# EasyEDA Pro project 电路原理图和PCB图.eprj

# Schematic Schematic2_1
Board Name: Board2_1; Create Date: 2024-09-04; Page Name: P1_1; Project Name: 电路原理图和PCB图; Schematic Name: Schematic2_1; Update Date: 2026-04-20; Company: 23光信1; Reviewed: 何晓燊; Version: V114.514
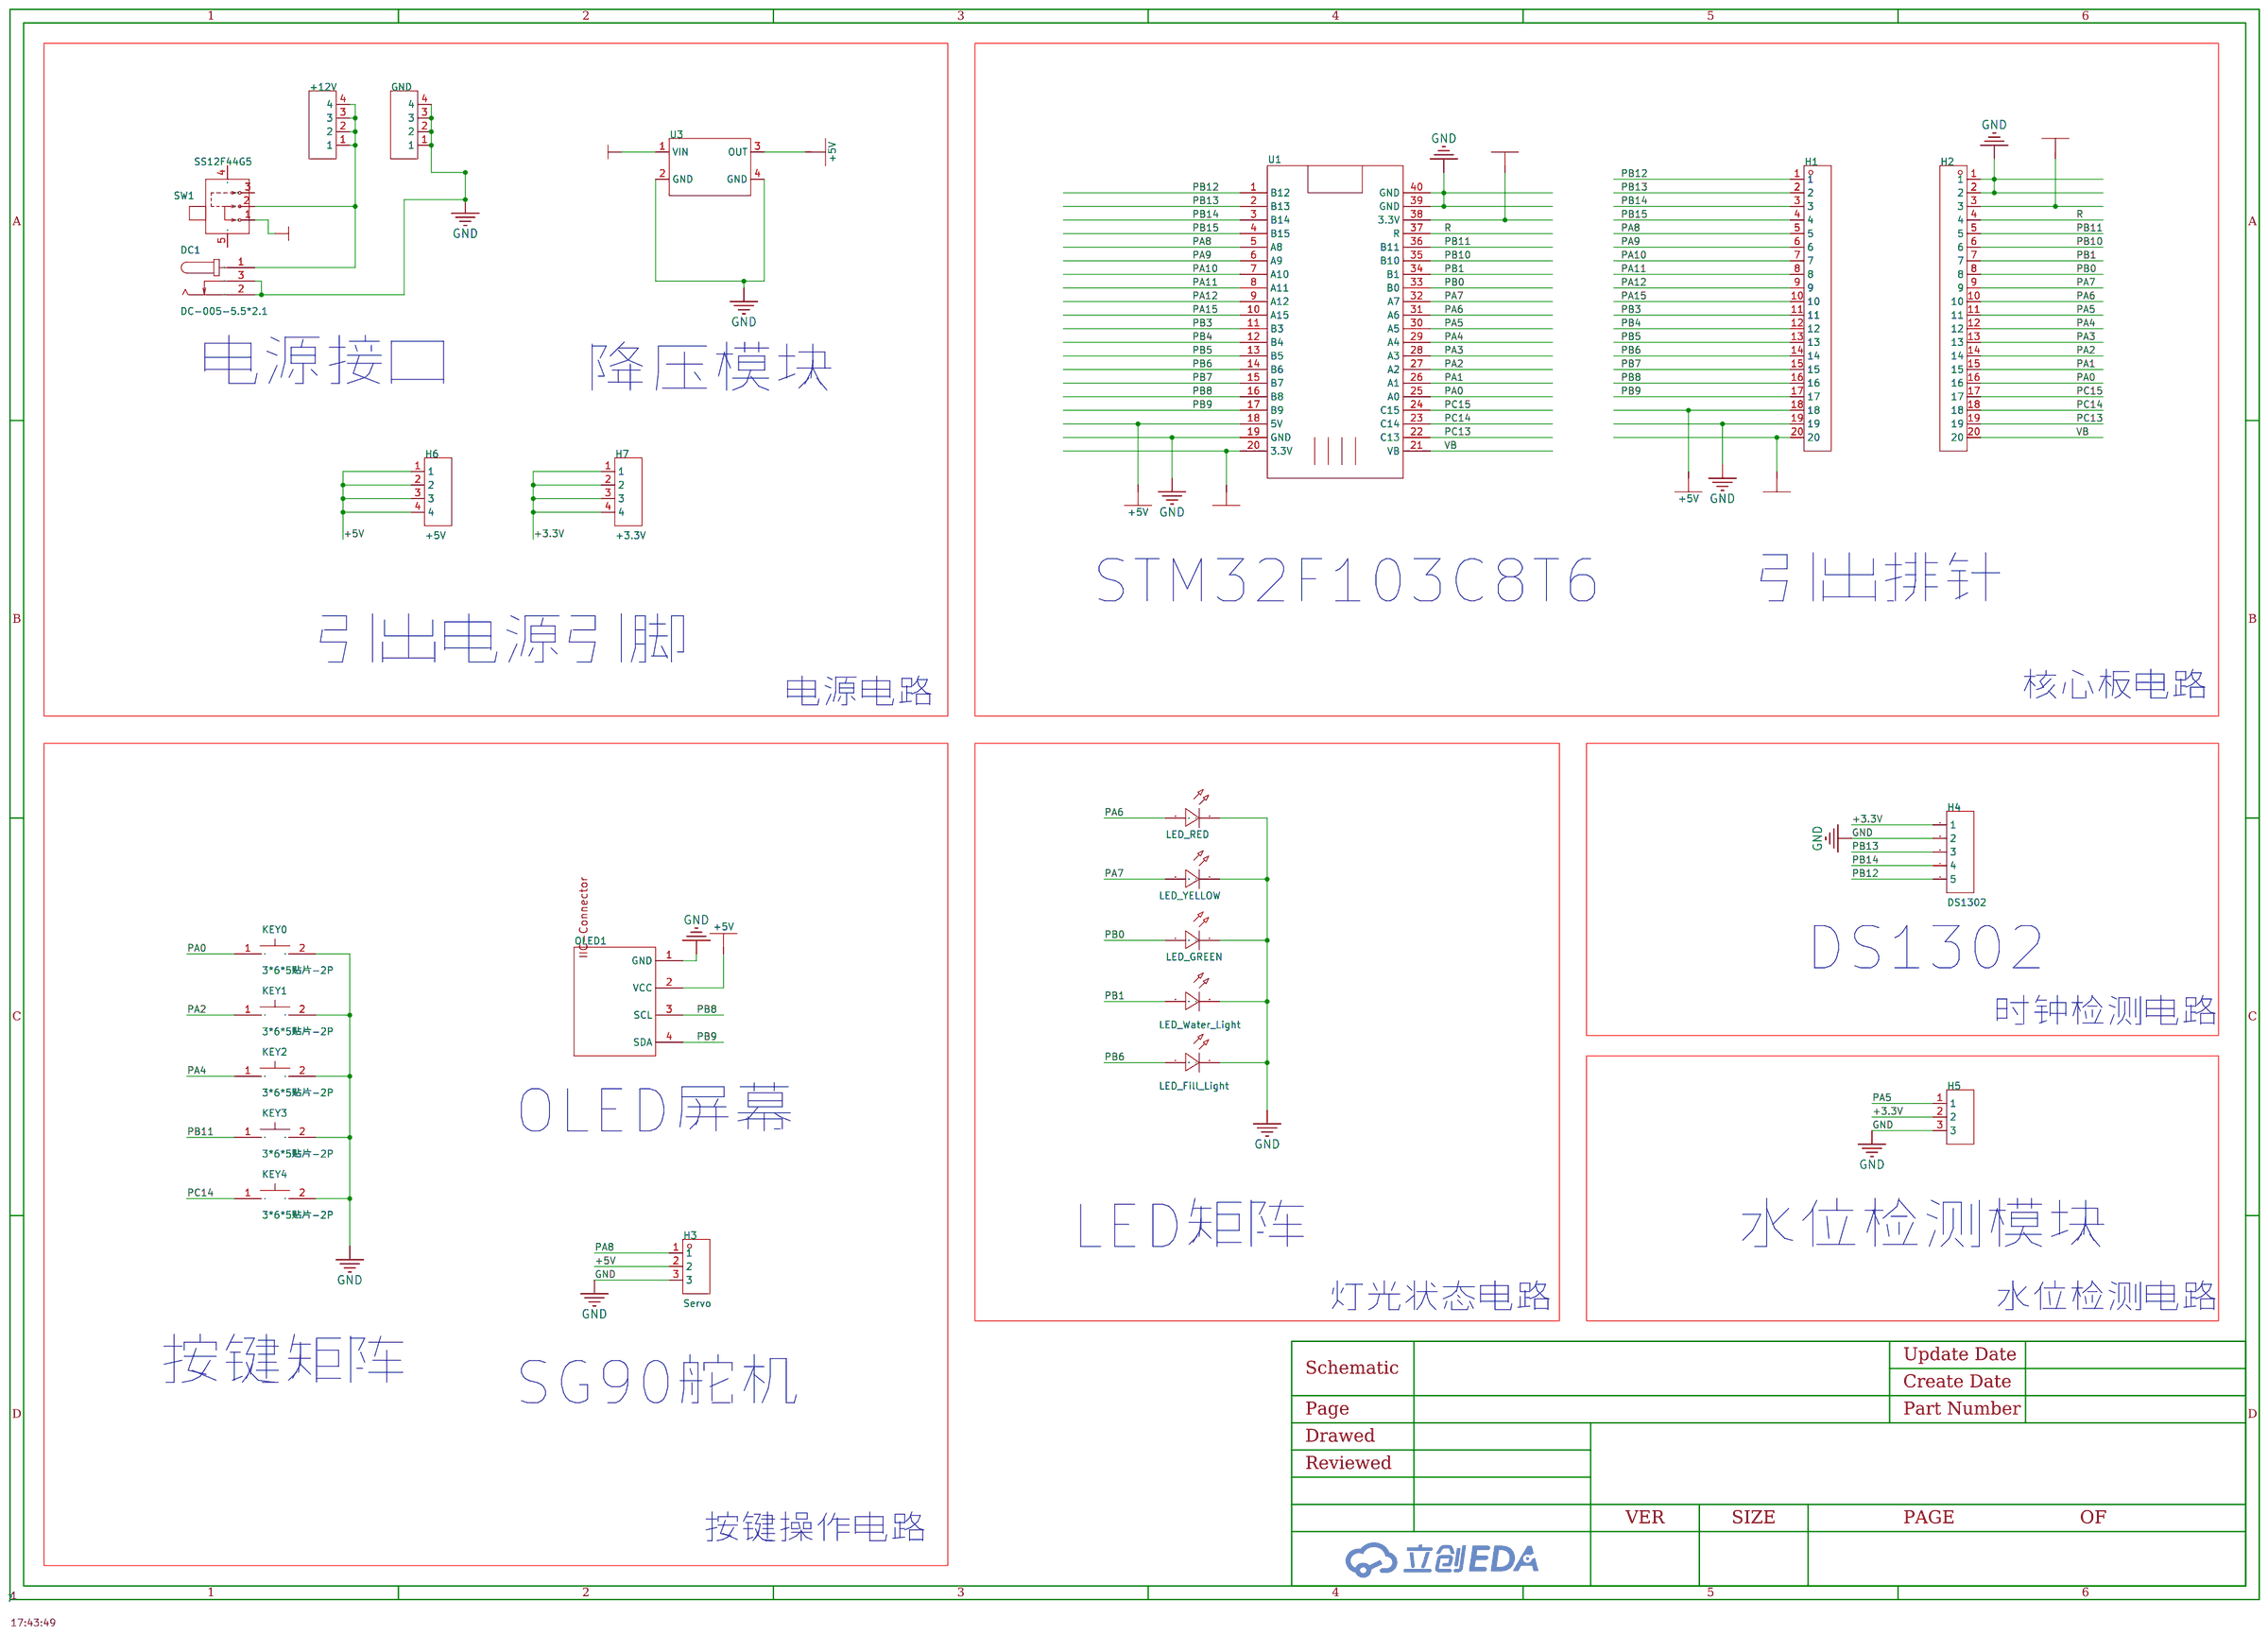
[diagram p0: schematic sheet]

## Parts
+12V  -  [HDR-TH_4P-P2.54-V-M]
DC1  DC-005-5.5*2.1  [DC-IN-TH_DC-005-2]
GND  -  [HDR-TH_4P-P2.54-V-M]
H1  -  [HDR-TH_20P-P2.54-V-M-1]
H2  -  [HDR-TH_20P-P2.54-V-M-1]
H3  Servo  [HDR-TH_3P-P2.54-V-M]
H4  DS1302  [HDR-TH_5P-P2.54-V-F]
H5  -  [HDR-TH_3P-P2.54-V-F]
H6  +5V  [HDR-TH_4P-P2.54-V-M]
H7  +3.3V  [HDR-TH_4P-P2.54-V-M]
KEY0  3*6*5贴片-2P  [SW-SMD_L6.0-W3.5-LS8.0]
KEY1  3*6*5贴片-2P  [SW-SMD_L6.0-W3.5-LS8.0]
KEY2  3*6*5贴片-2P  [SW-SMD_L6.0-W3.5-LS8.0]
KEY3  3*6*5贴片-2P  [SW-SMD_L6.0-W3.5-LS8.0]
KEY4  3*6*5贴片-2P  [SW-SMD_L6.0-W3.5-LS8.0]
LED_Fill_Light  -  [LED_TH-_5mm]
LED_GREEN  -  [LED_TH-_5mm]
LED_RED  -  [LED_TH-_5mm]
LED_Water_Light  -  [LED_TH-_5mm]
LED_YELLOW  -  [LED_TH-_5mm]
OLED1  -  [0.96OLED_4P]
SW1  SS12F44G5  [SW-TH_SHOU-HAN_SS12F44G4]
U1  -  [STM32F103C8T6核心板]
U3  -  [MP1584模块]

## Library data of the parts
+12V GND H6 H7 = HDR-M_2.54_1x4P: Supplier Part: C492403; Supplier Footprint: 插件
DC1 = DC-005-5.5*2.1: Supplier Part: C9900017044; Supplier Footprint: DC-005; JLCPCB Part Class: 扩展库; Supplier: LCSC
H1 H2 = HDR-M_2.54_1x20P: Supplier Part: C50981; Supplier Footprint: 插件
H3 = HDR-M_2.54_1x3P: Supplier Part: C2937625; Supplier Footprint: 插件
H4 = HDR-F_2.54_1x5P: Supplier Part: C50950; Supplier Footprint: 插件
H5 = HDR-F_2.54_1x3P: Supplier Part: C541850; Supplier Footprint: 插件
KEY0-KEY4 = 3*6*5贴片-2P: Supplier Part: C9900011307; Supplier Footprint: SW-SMD; JLCPCB Part Class: 扩展库; Supplier: LCSC
LED_Fill_Light LED_Water_Light LED_YELLOW = LED_TH-B_5mm: Supplier Footprint: 插件
LED_GREEN = LED_TH-G_5mm: Supplier Footprint: 插件
LED_RED = LED_TH-R_5mm: Supplier Footprint: 插件
OLED1 = 0.96OLED_4P: LCSC Part Name: 0.96OLED_4P_MODULE_JX; Supplier Part: C9900004566; Manufacturer Part: 0.96OLED_4P_MODULE_JX; Supplier Footprint: THrough hole; JLCPCB Part Class: Extended Part; Supplier: LCSC
SW1 = SS12F44G5: Supplier Part: C22435641; Manufacturer: HanElectricity(瀚源); Supplier Footprint: 插件-5P,12.2x5.5mm; JLCPCB Part Class: 扩展库; Datasheet: https://atta.szlcsc.com/upload/public/pdf/source/20240521/251CCE5309E68669C05257185F219EB8.pdf; Supplier: LCSC
U1 = stm32f103c8t6最小系统板
U3 = MP1584模块: Pin Type: IN

## Nets
+3.3V: H1.20 H2.3 H4.1 H5.2 H7.1 H7.2 H7.3 H7.4 U1.20(3.3V) U1.38(3.3V)
+5V: H1.18 H3.2 H6.1 H6.2 H6.3 H6.4 OLED1.2(VCC) U1.18(5V) U3.3(OUT)
+12V: SW1.1 U3.1(VIN)
GND: DC1.2 DC1.3 GND.1 GND.2 GND.3 GND.4 H1.19 H2.1 H2.2 H3.3 H4.2 H5.3 KEY0.2 KEY1.2 KEY2.2 KEY3.2 KEY4.2 LED_Fill_Light.2(A) LED_GREEN.2(A) LED_RED.2(A) LED_Water_Light.2(A) LED_YELLOW.2(A) OLED1.1(GND) U1.19(GND) U1.39(GND) U1.40(GND) U3.2(GND) U3.4(GND)
PA0: H2.16 KEY0.1 U1.25(A0)
PA1: H2.15 U1.26(A1)
PA2: H2.14 KEY1.1 U1.27(A2)
PA3: H2.13 U1.28(A3)
PA4: H2.12 KEY2.1 U1.29(A4)
PA5: H2.11 H5.1 U1.30(A5)
PA6: H2.10 LED_RED.1(C) U1.31(A6)
PA7: H2.9 LED_YELLOW.1(C) U1.32(A7)
PA8: H1.5 H3.1 U1.5(A8)
PA9: H1.6 U1.6(A9)
PA10: H1.7 U1.7(A10)
PA11: H1.8 U1.8(A11)
PA12: H1.9 U1.9(A12)
PA15: H1.10 U1.10(A15)
PB0: H2.8 LED_GREEN.1(C) U1.33(B0)
PB1: H2.7 LED_Water_Light.1(C) U1.34(B1)
PB3: H1.11 U1.11(B3)
PB4: H1.12 U1.12(B4)
PB5: H1.13 U1.13(B5)
PB6: H1.14 LED_Fill_Light.1(C) U1.14(B6)
PB7: H1.15 U1.15(B7)
PB8: H1.16 OLED1.3(SCL) U1.16(B8)
PB9: H1.17 OLED1.4(SDA) U1.17(B9)
PB10: H2.6 U1.35(B10)
PB11: H2.5 KEY3.1 U1.36(B11)
PB12: H1.1 H4.5 U1.1(B12)
PB13: H1.2 H4.3 U1.2(B13)
PB14: H1.3 H4.4 U1.3(B14)
PB15: H1.4 U1.4(B15)
PC13: H2.19 U1.22(C13)
PC14: H2.18 KEY4.1 U1.23(C14)
PC15: H2.17 U1.24(C15)
R: H2.4 U1.37(R)
VB: H2.20 U1.21(VB)
Net-(+12V-1): +12V.1 +12V.2 +12V.3 +12V.4 DC1.1 SW1.2

Not connected (* = marked no-connect by the designer): SW1 3 4 5

## Notes on the sheet
- 电源接口
- 降压模块
- STM32F103C8T6
- 引出排针
- 引出电源引脚
- 核心板电路
- 电源电路
- DS1302
- 时钟检测电路
- OLED屏幕
- LED矩阵
- 水位检测模块
- 灯光状态电路
- 水位检测电路
- 按键矩阵
- SG90舵机
- 按键操作电路

# Board 标准版
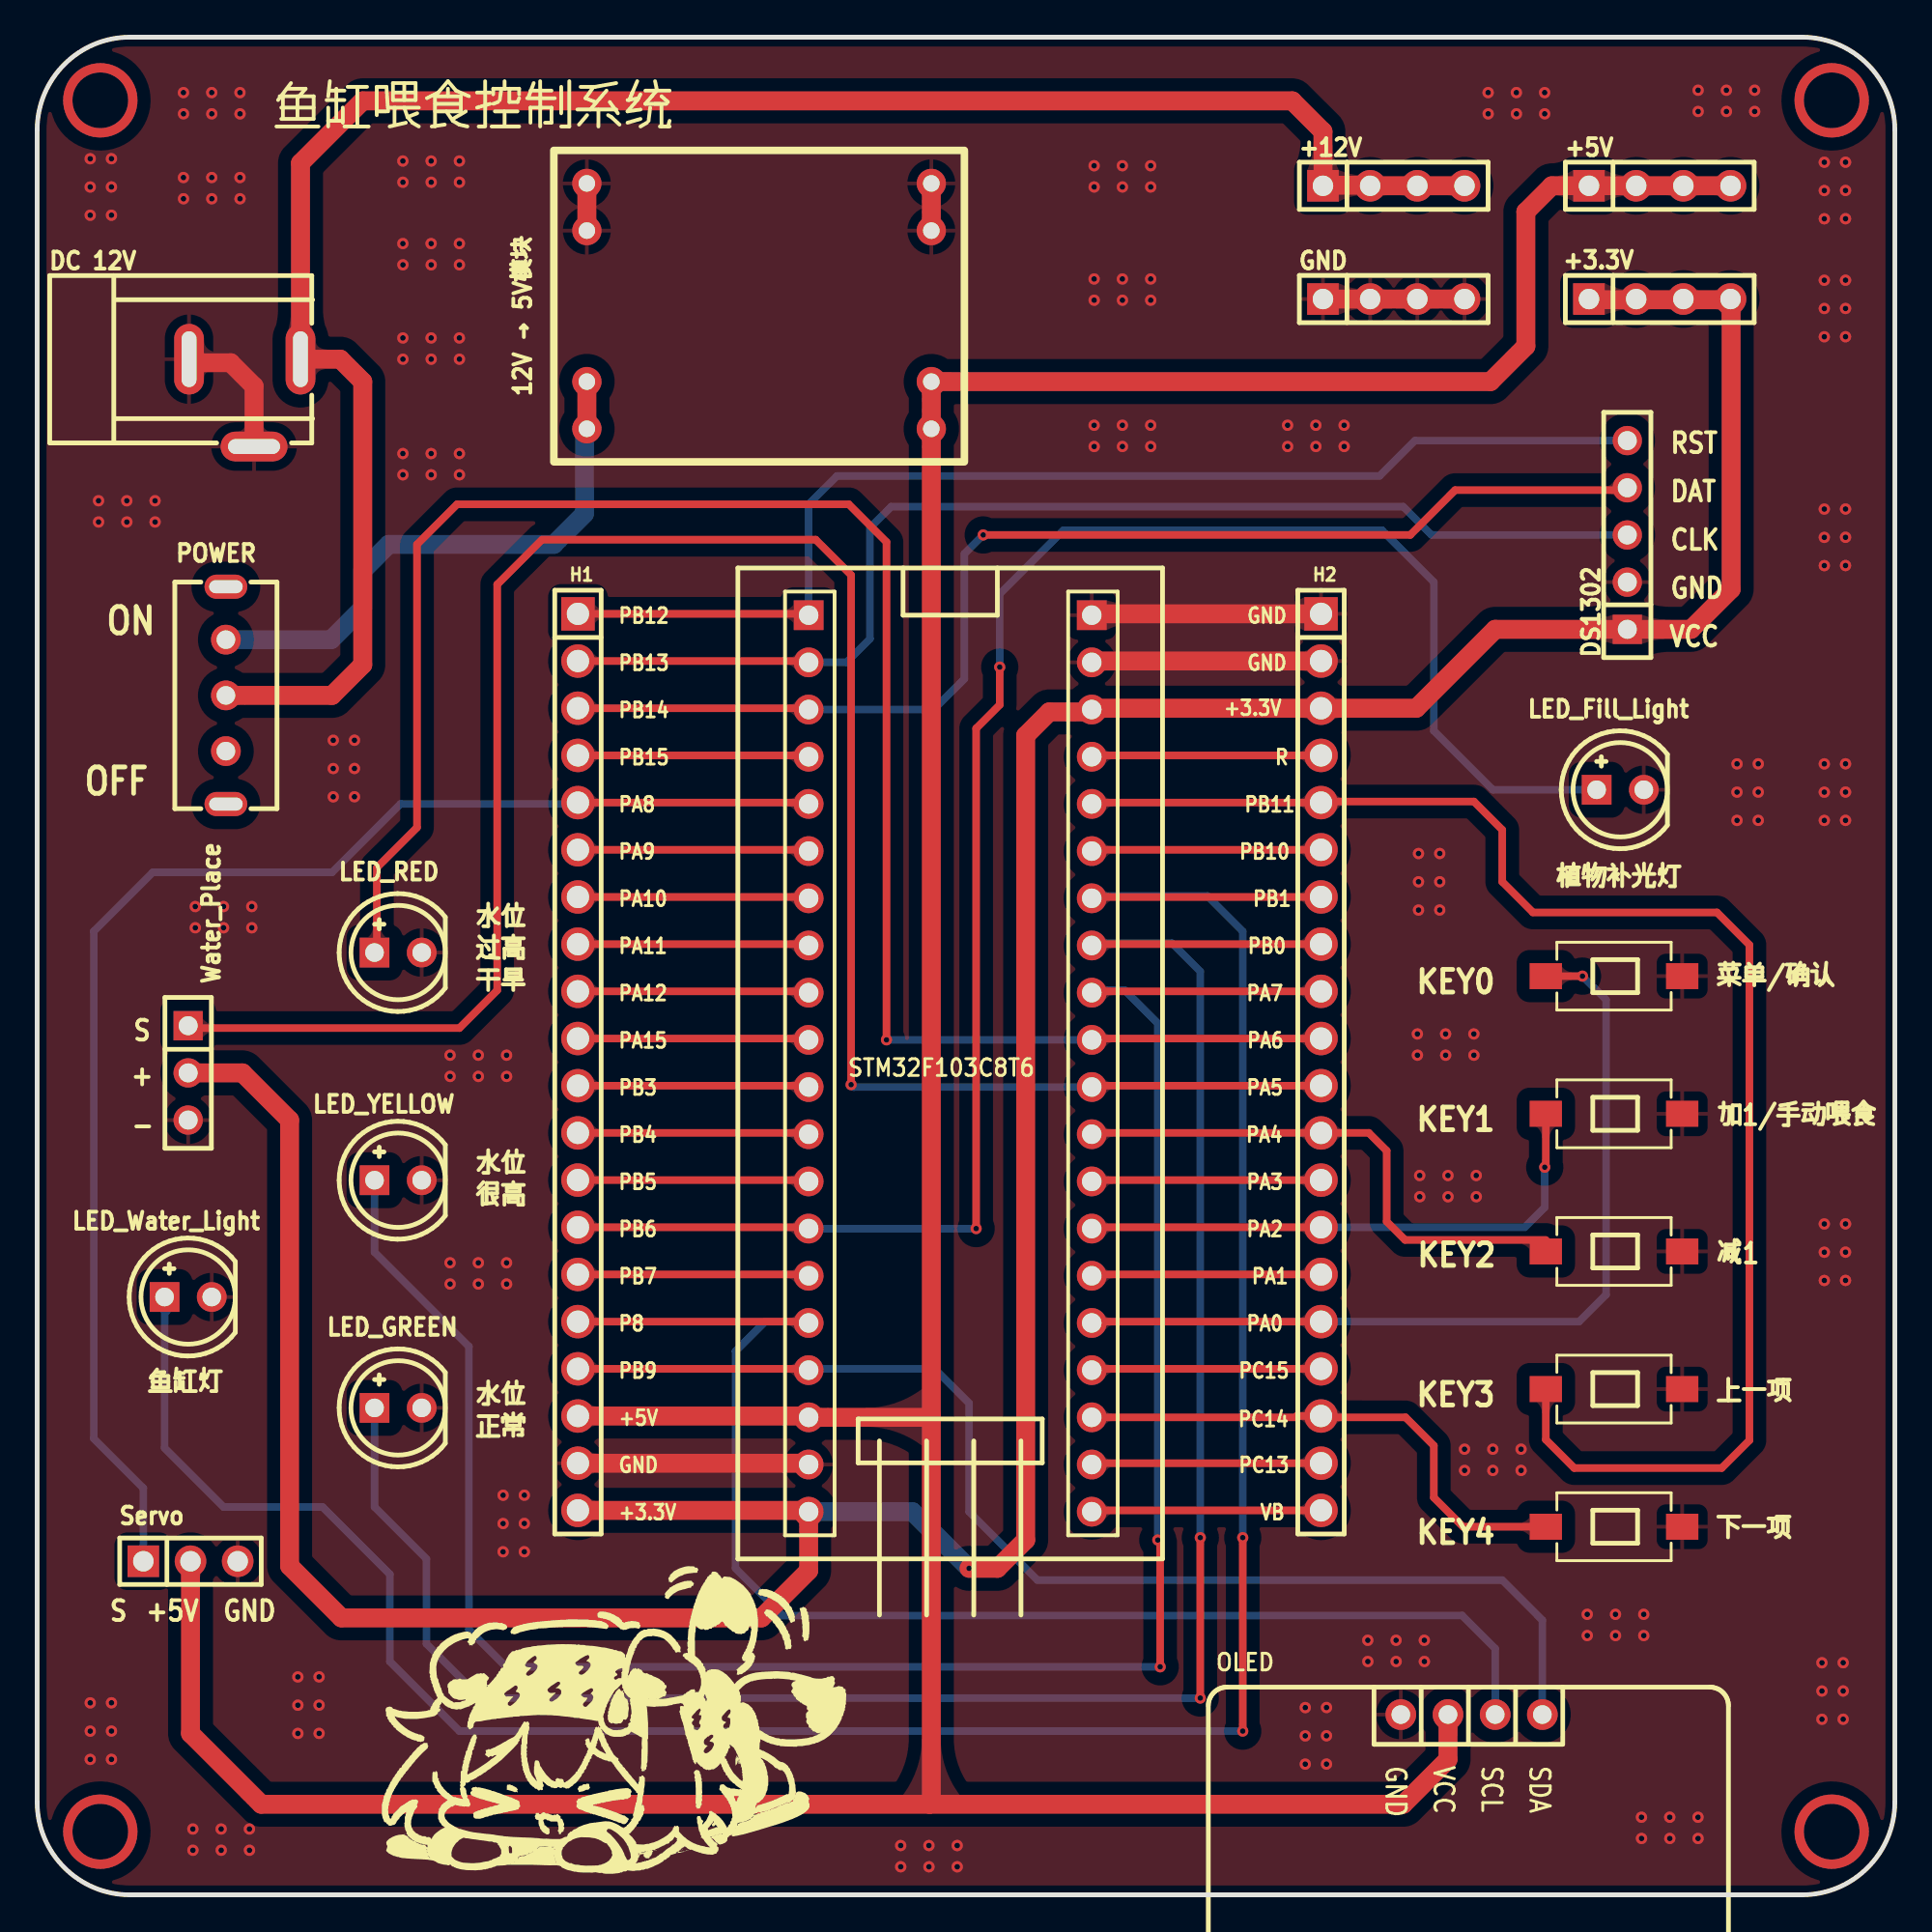
[diagram p1: board, top side]
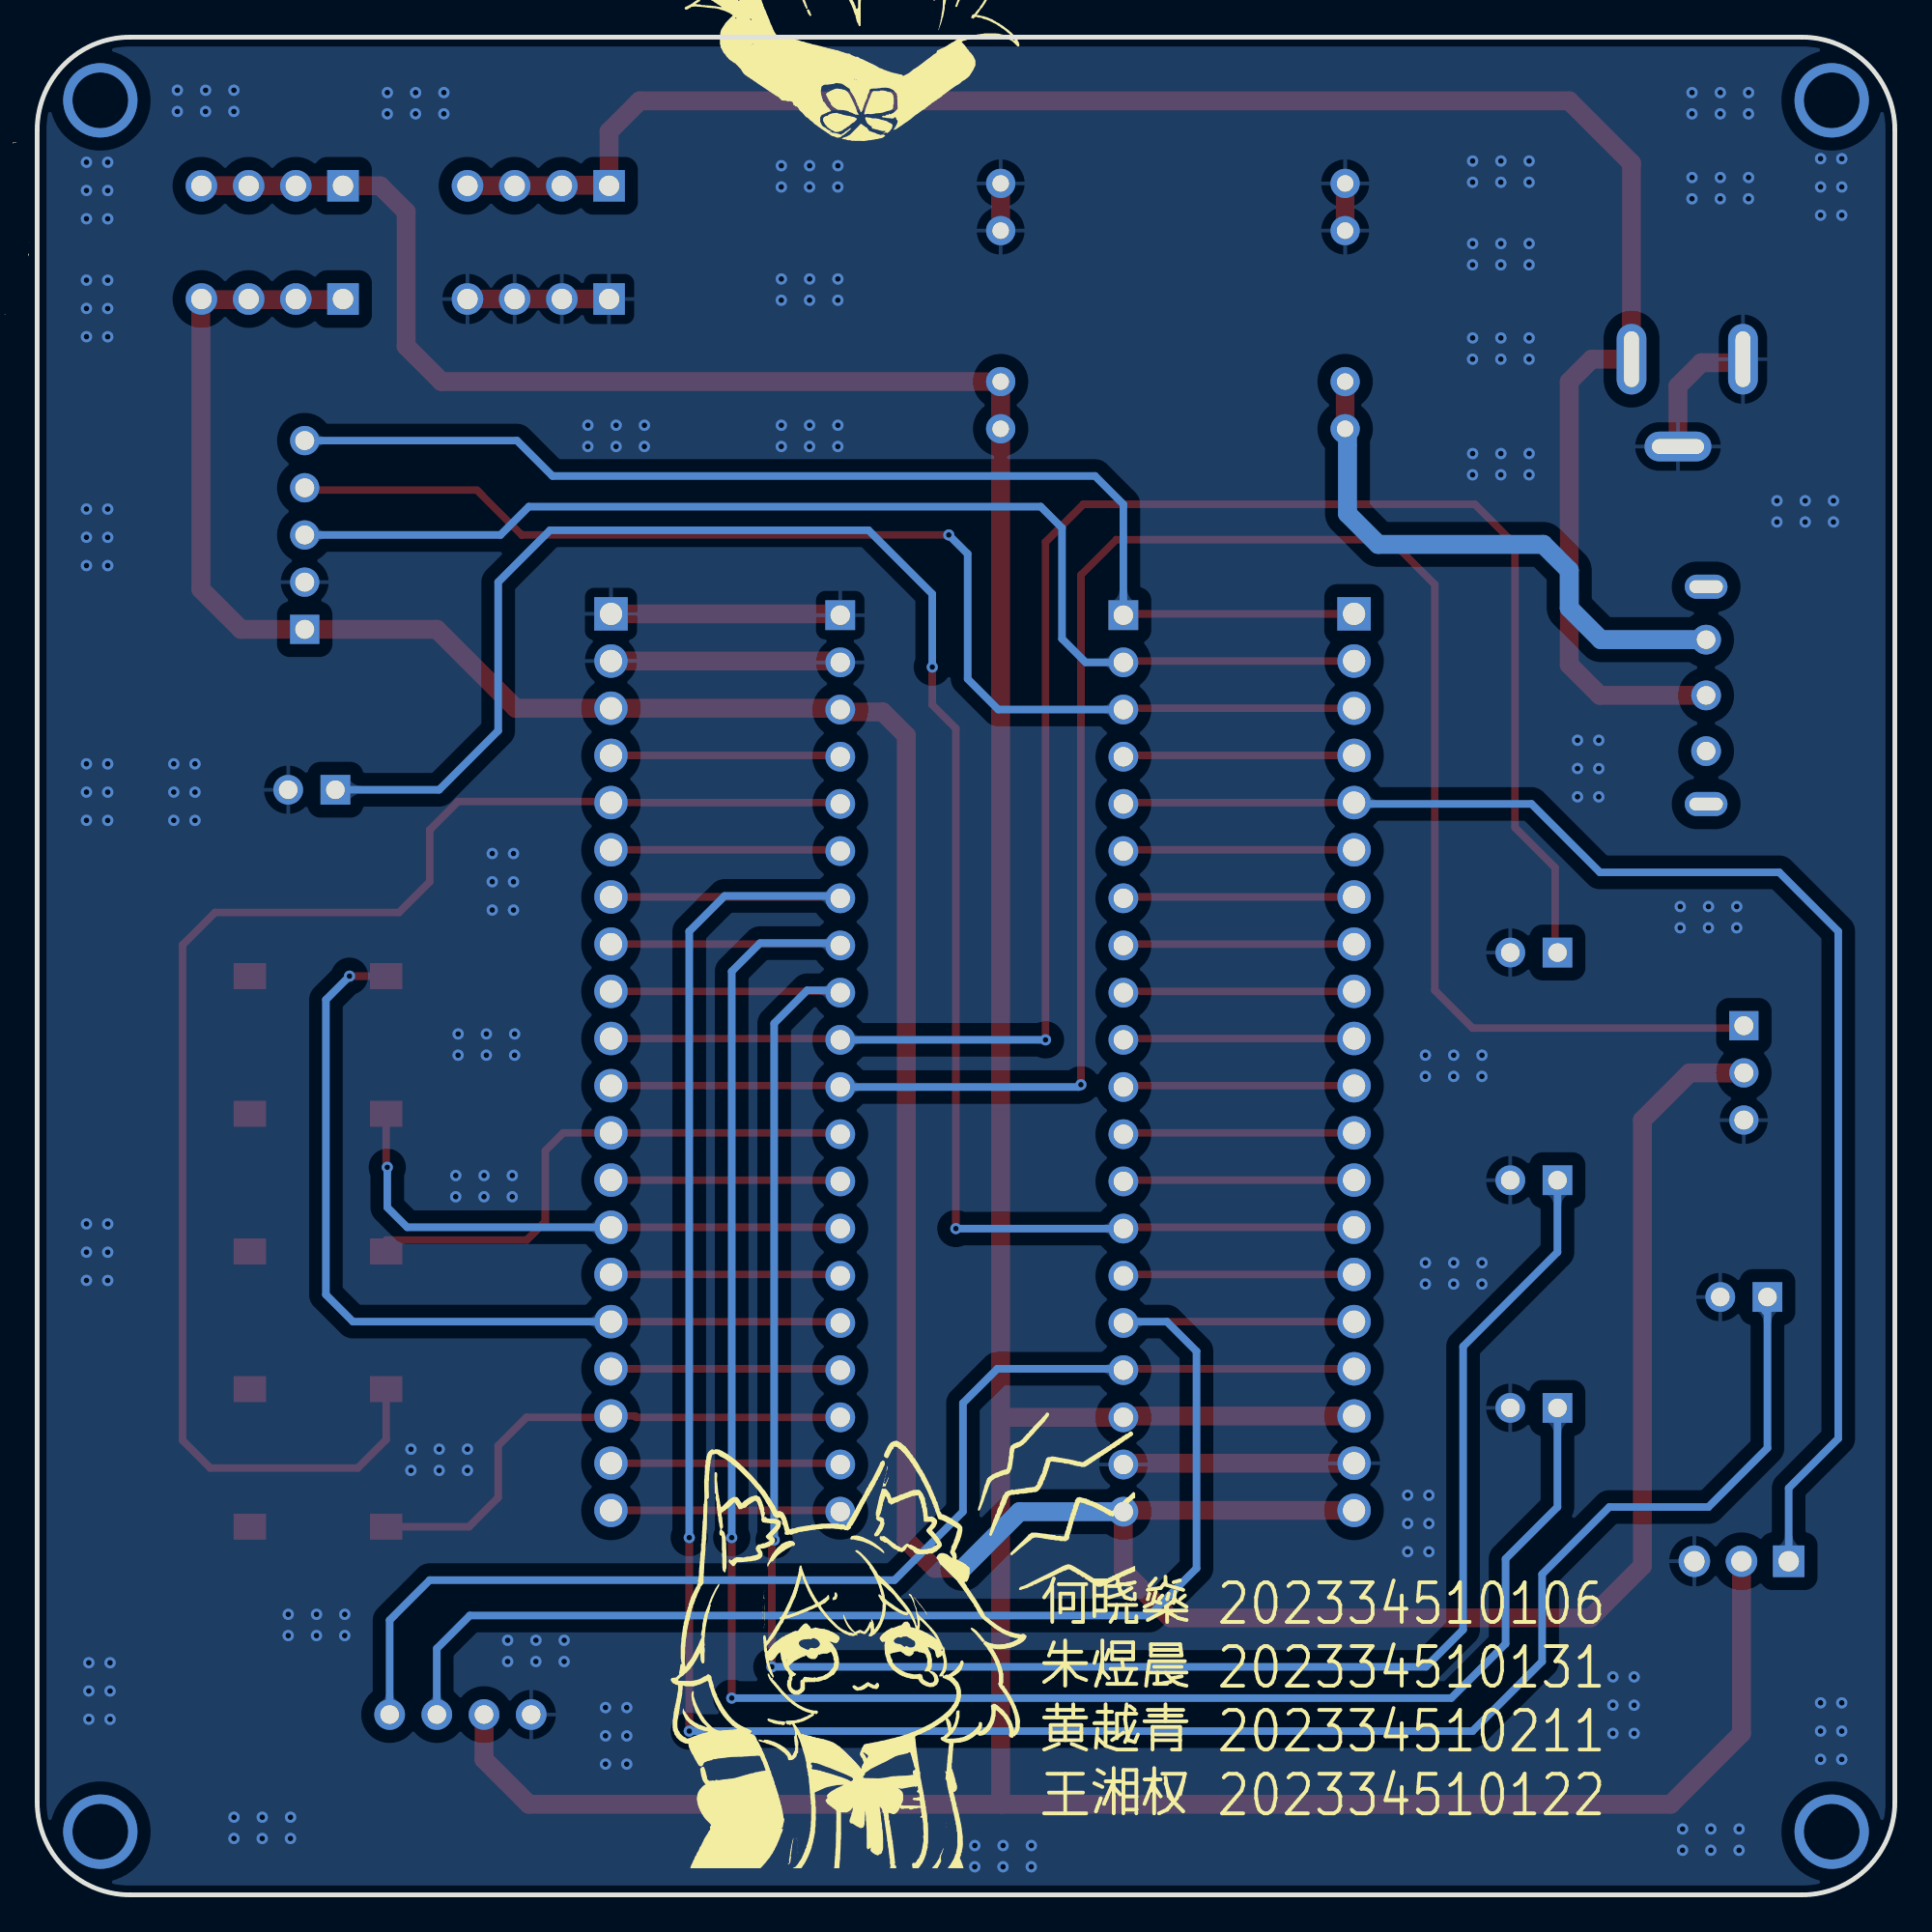
[diagram p2: board, bottom side, seen from below]

Outline 100 x 100 mm; copper layers: Top Layer, Bottom Layer. Coordinates in mm from the lower left corner of the outline.
Outline path: 0,95 0,5 arc(1.46,1.46) 5,0 95,0 arc(98.54,1.46) 100,5 100,95 arc(98.54,98.54) 95,100 5,100 arc(1.46,98.54) 0,95
Stack: Top Layer 0.035mm / Dielectric1 1.51mm FR4 er 4.5 / Bottom Layer 0.035mm

## Design rules (mm)
template: 用户自定义配置
spacing safeClearance (default): track to track 0.5, other pairs 0.5 to 0.5
track width trackWidth (default): min 0.127, default 0.254, max 2.54
differential pair differentialPair (default): width min 0.127, default 0.254, max 2.54; gap min 0.152, default 0.152
via viaSize (default): diameter min 0.5, default 0.61, max 10; hole min 0.3, default 0.305, max 6

## Placement (name value [footprint] x y rotation side)
12V → 5V模块  -  [MP1584模块]  38.86 85.52 0 top
+3.3V  +3.3V  [HDR-TH_4P-P2.54-V-M]  87.35 85.9 0 top
+5V  +5V  [HDR-TH_4P-P2.54-V-M]  87.35 92 0 top
+12V  -  [HDR-TH_4P-P2.54-V-M]  73.03 92 0 top
DC 12V  DC-005-5.5*2.1  [DC-IN-TH_DC-005-2]  11.18 80.31 0 top
DS1302  DS1302  [HDR-TH_5P-P2.54-V-F]  85.6 73.2 90 top
GND  -  [HDR-TH_4P-P2.54-V-M]  73.03 85.9 0 top
H1  -  [HDR-TH_20P-P2.54-V-M-1]  29.11 44.83 270 top
H2  -  [HDR-TH_20P-P2.54-V-M-1]  69.11 44.83 270 top
KEY0  3*6*5贴片-2P  [SW-SMD_L6.0-W3.5-LS8.0]  84.88 49.45 0 top
KEY1  3*6*5贴片-2P  [SW-SMD_L6.0-W3.5-LS8.0]  84.88 42.04 0 top
KEY2  3*6*5贴片-2P  [SW-SMD_L6.0-W3.5-LS8.0]  84.88 34.63 0 top
KEY3  3*6*5贴片-2P  [SW-SMD_L6.0-W3.5-LS8.0]  84.88 27.22 0 top
KEY4  3*6*5贴片-2P  [SW-SMD_L6.0-W3.5-LS8.0]  84.88 19.82 0 top
LED_Fill_Light  -  [LED_TH-_5mm]  85.22 59.49 0 top
LED_GREEN  -  [LED_TH-_5mm]  19.43 26.21 0 top
LED_RED  -  [LED_TH-_5mm]  19.43 50.72 0 top
LED_Water_Light  -  [LED_TH-_5mm]  8.13 32.18 0 top
LED_YELLOW  -  [LED_TH-_5mm]  19.43 38.47 0 top
OLED  -  [0.96OLED_4P]  77.22 9.7 0 top
POWER  SS12F44G5  [SW-TH_SHOU-HAN_SS12F44G4]  10.16 64.57 270 top
Servo  Servo  [HDR-TH_3P-P2.54-V-M]  8.25 17.96 0 top
STM32F103C8T6  -  [STM32F103C8T6核心板]  49.15 44.75 0 top
Water_Place  -  [HDR-TH_3P-P2.54-V-F]  8.13 44.25 270 top

## Footprints (pads in the part's own frame, mm; a bottom-side part is the same pattern mirrored in y, then rotated)
0.96OLED_4P
  round 1.651 hole 1.001: 1(-3.81,0) 2(-1.27,0.003) 3(1.27,0.003) 4(3.81,0.003)
DC-IN-TH_DC-005-2
  oval 1.6x3.8 hole 0.8x3: 1(2.999,2.35) 2(-3,2.35)
  oval 3.6x1.6 hole 2.8x0.8: 3(0.5,-2.35)
HDR-TH_3P-P2.54-V-F
  rect 1.575x1.575 hole 1.02: 1(-2.54,0)
  round 1.575 hole 1.02: 2(0,0) 3(2.54,0)
HDR-TH_3P-P2.54-V-M
  rect 1.7x1.7 hole 1.1: 1(-2.54,0)
  round 1.7 hole 1.1: 2(0,0) 3(2.54,0)
HDR-TH_4P-P2.54-V-M
  rect 1.7x1.7 hole 1.1: 1(-3.81,0)
  round 1.7 hole 1.1: 2(-1.27,0) 3(1.27,0) 4(3.81,0)
HDR-TH_5P-P2.54-V-F
  rect 1.575x1.575 hole 1.02: 1(-5.08,0)
  round 1.575 hole 1.02: 2(-2.54,0) 3(0,0) 4(2.54,0) 5(5.08,0)
HDR-TH_20P-P2.54-V-M-1
  rect 1.8x1.8 hole 1.2: 1(-24.13,0)
  round 1.8 hole 1.2: 2(-21.59,0) 3(-19.05,0) 4(-16.51,0) 5(-13.97,0) 6(-11.43,0) 7(-8.89,0) 8(-6.35,0) 9(-3.81,0) 10(-1.27,0) 11(1.27,0) 12(3.81,0) 13(6.35,0) 14(8.89,0) 15(11.43,0) 16(13.97,0) 17(16.51,0) 18(19.05,0) 19(21.59,0) 20(24.13,0)
LED_TH-_5mm
  rect 1.6x1.6 hole 1: 1(-1.27,0)
  round 1.6 hole 1: 2(1.27,0)
MP1584模块
  round 1.575 hole 0.889: 1(-9.271,-4.064) 1(-9.271,-6.604) 2(-9.271,6.604) 2(-9.271,4.064) 3(9.271,-4.064) 3(9.271,-6.604) 4(9.271,6.604) 4(9.271,4.064)
STM32F103C8T6核心板
  rect 1.6x1.6 hole 1.049: 1(-7.62,24.13) 40(7.62,24.13)
  round 1.6 hole 1.049: 2(-7.62,21.59) 3(-7.62,19.05) 4(-7.62,16.51) 5(-7.62,13.97) 6(-7.62,11.43) 7(-7.62,8.89) 8(-7.62,6.35) 9(-7.62,3.81) 10(-7.62,1.27) 11(-7.62,-1.27) 12(-7.62,-3.81) 13(-7.62,-6.35) 14(-7.62,-8.89) 15(-7.62,-11.43) 16(-7.62,-13.97) 17(-7.62,-16.51) 18(-7.62,-19.05) 19(-7.62,-21.59) 20(-7.62,-24.13) 21(7.62,-24.13) 22(7.62,-21.59) 23(7.62,-19.05) 24(7.62,-16.51) 25(7.62,-13.97) 26(7.62,-11.43) 27(7.62,-8.89) 28(7.62,-6.35) 29(7.62,-3.81) 30(7.62,-1.27) 31(7.62,1.27) 32(7.62,3.81) 33(7.62,6.35) 34(7.62,8.89) 35(7.62,11.43) 36(7.62,13.97) 37(7.62,16.51) 38(7.62,19.05) 39(7.62,21.59)
SW-SMD_L6.0-W3.5-LS8.0
  rect 1.74x1.4 smd: 1(-3.67,0) 2(3.67,0)
SW-TH_SHOU-HAN_SS12F44G4
  round 1.6 hole 1: 1(-3,0) 2(0,0) 3(3,0)
  oval 1.3x2.3 hole 0.7x1.8: 4(5.85,0) 5(-5.85,0)

## Nets
+3.3V: +3.3V.1 +3.3V.2 +3.3V.3 +3.3V.4 DS1302.1 H1.20 H2.3 STM32F103C8T6.20 STM32F103C8T6.38 Water_Place.2
+5V: 12V → 5V模块.3 +5V.1 +5V.2 +5V.3 +5V.4 H1.18 OLED.2 Servo.2 STM32F103C8T6.18
+12V: 12V → 5V模块.1 POWER.1
GND: 12V → 5V模块.2 12V → 5V模块.4 DC 12V.2 DC 12V.3 DS1302.2 GND.1 GND.2 GND.3 GND.4 H1.19 H2.1 H2.2 KEY0.2 KEY1.2 KEY2.2 KEY3.2 KEY4.2 LED_Fill_Light.2 LED_GREEN.2 LED_RED.2 LED_Water_Light.2 LED_YELLOW.2 OLED.1 Servo.3 STM32F103C8T6.19 STM32F103C8T6.39 STM32F103C8T6.40 Water_Place.3
PA0: H2.16 KEY0.1 STM32F103C8T6.25
PA1: H2.15 STM32F103C8T6.26
PA2: H2.14 KEY1.1 STM32F103C8T6.27
PA3: H2.13 STM32F103C8T6.28
PA4: H2.12 KEY2.1 STM32F103C8T6.29
PA5: H2.11 STM32F103C8T6.30 Water_Place.1
PA6: H2.10 LED_RED.1 STM32F103C8T6.31
PA7: H2.9 LED_YELLOW.1 STM32F103C8T6.32
PA8: H1.5 Servo.1 STM32F103C8T6.5
PA9: H1.6 STM32F103C8T6.6
PA10: H1.7 STM32F103C8T6.7
PA11: H1.8 STM32F103C8T6.8
PA12: H1.9 STM32F103C8T6.9
PA15: H1.10 STM32F103C8T6.10
PB0: H2.8 LED_GREEN.1 STM32F103C8T6.33
PB1: H2.7 LED_Water_Light.1 STM32F103C8T6.34
PB3: H1.11 STM32F103C8T6.11
PB4: H1.12 STM32F103C8T6.12
PB5: H1.13 STM32F103C8T6.13
PB6: H1.14 LED_Fill_Light.1 STM32F103C8T6.14
PB7: H1.15 STM32F103C8T6.15
PB8: H1.16 OLED.3 STM32F103C8T6.16
PB9: H1.17 OLED.4 STM32F103C8T6.17
PB10: H2.6 STM32F103C8T6.35
PB11: H2.5 KEY3.1 STM32F103C8T6.36
PB12: DS1302.5 H1.1 STM32F103C8T6.1
PB13: DS1302.3 H1.2 STM32F103C8T6.2
PB14: DS1302.4 H1.3 STM32F103C8T6.3
PB15: H1.4 STM32F103C8T6.4
PC13: H2.19 STM32F103C8T6.22
PC14: H2.18 KEY4.1 STM32F103C8T6.23
PC15: H2.17 STM32F103C8T6.24
R: H2.4 STM32F103C8T6.37
VB: H2.20 STM32F103C8T6.21
$3N3363: +12V.1 +12V.2 +12V.3 +12V.4 DC 12V.1 POWER.2

Pads without a net: POWER 3 4 5

## Via types
v1: diameter 4, hole 3, Top Layer to Bottom Layer, 4 vias
v2: diameter 0.61, hole 0.305, Top Layer to Bottom Layer, 228 vias
v3: diameter 0.6, hole 0.3, Top Layer to Bottom Layer, 14 vias

## Routing (per net, layer and track width the routed paths; a pad name or vN(x,y) marks a point on that pad's centre or on a via; arc(x,y) is an arc through that point)
+3.3V: length 197.1
  Top Layer w1.016: H1.20 41.49,20.7 41.53,20.66 41.53,17.45 38.99,14.91 16.38,14.91 13.59,17.7 13.59,41.71 11.05,44.25 Water_Place.2 ; 83.54,85.87 91.16,85.87 91.19,85.83 91.19,70.28 89.03,68.12 DS1302.1 78.49,68.12 74.24,63.88 H2.3 56.73,63.88 ; 56.26,63.68 54.48,63.68 53.21,62.41 53.21,19.1 51.69,17.58 v3(50.16,17.58)
  Bottom Layer w1.016: STM32F103C8T6.20 47.12,20.62 v3(50.16,17.58)
+5V: length 229.3
  Top Layer w1.016: 48.13,25.83 12V → 5V模块.3 12V → 5V模块.3 78.23,81.46 80.14,83.36 80.14,90.6 81.53,92 91.19,92 ; 48.13,25.83 48.01,25.71 41.56,25.71 41.49,25.78 H1.18 ; 48.13,25.83 48.13,4.96 48.05,4.88 ; 48.05,4.88 12.06,4.88 8.25,8.69 Servo.2 ; 48.05,4.88 73.53,4.88 75.95,7.29 OLED.2
+12V: length 30.5
  Top Layer w1.016: 12V → 5V模块.1 12V → 5V模块.1
  Bottom Layer w1.016: 12V → 5V模块.1 29.46,78.79 29.46,74.35 27.81,72.69 18.92,72.69 17.53,71.3 17.53,69.27 15.83,67.57 POWER.1
GND: length 57.2
  Top Layer w1.016: 12V → 5V模块.2 12V → 5V模块.2 ; GND.4 GND.3 GND.2 GND.1 ; DC 12V.3 11.68,81.21 10.41,82.47 8.37,82.47 DC 12V.2 ; 56.73,68.96 H2.1 ; H1.19 41.49,23.24 ; 56.73,66.42 H2.2 ; 12V → 5V模块.4 12V → 5V模块.4
  vias: v2(2.86,93.46) v2(2.86,91.93) v2(2.86,90.41) v2(2.86,10.33) v2(2.86,8.81) v2(2.86,7.29) v2(3.3,75.04) v2(3.31,73.9) v2(4,93.46) v2(4,91.94) v2(4,90.42) v2(4,10.34) v2(4,8.82) v2(4,7.29) v2(4.82,75.04) v2(4.83,73.9) v2(6.35,75.04) v2(6.35,73.9) v2(7.88,97.02) v2(7.88,95.87) v2(7.88,92.44) v2(7.88,91.3) v2(8.38,3.54) v2(8.39,2.4) v2(8.51,53.2) v2(8.51,52.06) v2(9.4,97.02) v2(9.4,95.87) v2(9.4,92.44) v2(9.4,91.3) v2(9.9,3.54) v2(9.91,2.4) v2(10.03,53.2) v2(10.03,52.06) v2(10.92,97.02) v2(10.92,95.87) v2(10.92,92.44) v2(10.92,91.3) v2(11.43,3.54) v2(11.43,2.4) v2(11.55,53.2) v2(11.56,52.06) v2(14.03,11.73) v2(14.03,10.21) v2(14.03,8.69) v2(15.18,11.73) v2(15.18,10.21) v2(15.18,8.69) v2(15.94,62.15) v2(15.94,60.63) v2(15.94,59.11) v2(17.08,62.15) v2(17.08,60.63) v2(17.08,59.11) v2(19.69,93.33) v2(19.69,92.19) v2(19.69,88.89) v2(19.69,87.74) v2(19.69,83.81) v2(19.69,82.66) v2(19.69,77.58) v2(19.69,76.44) v2(21.21,93.33) v2(21.21,92.19) v2(21.21,88.89) v2(21.21,87.74) v2(21.21,83.81) v2(21.21,82.66) v2(21.21,77.58) v2(21.21,76.44) v2(22.23,45.2) v2(22.23,44.06) v2(22.23,34.02) v2(22.23,32.88) v2(22.73,93.33) v2(22.73,92.19) v2(22.73,88.89) v2(22.73,87.74) v2(22.73,83.81) v2(22.73,82.66) v2(22.73,77.58) v2(22.73,76.44) v2(23.75,45.2) v2(23.75,34.02) v2(23.75,44.06) v2(23.75,32.88) v2(25.08,21.51) v2(25.08,19.99) v2(25.08,18.47) v2(25.27,45.2) v2(25.27,44.06) v2(25.27,34.02) v2(25.27,32.88) v2(26.23,21.51) v2(26.23,19.99) v2(26.23,18.47) v2(46.48,2.65) v2(46.49,1.51) v2(48,2.65) v2(48.01,1.51) v2(49.53,2.65) v2(49.53,1.51) v2(56.9,93.08) v2(56.9,91.94) v2(56.9,86.98) v2(56.9,85.84) v2(56.9,79.11) v2(56.9,77.97) v2(58.42,93.08) v2(58.42,91.94) v2(58.42,86.98) v2(58.42,85.84) v2(58.42,79.11) v2(58.42,77.97) v2(59.94,93.08) v2(59.94,91.94) v2(59.94,86.98) v2(59.94,85.84) v2(59.94,79.11) v2(59.94,77.97) v2(67.31,79.11) v2(67.31,77.97) v2(68.26,10.08) v2(68.26,8.56) v2(68.26,7.04) v2(68.83,79.11) v2(68.84,77.97) v2(69.41,10.08) v2(69.41,8.56) v2(69.41,7.04) v2(70.35,79.11) v2(70.36,77.97) v2(71.63,13.7) v2(71.63,12.56) v2(73.15,13.7) v2(73.15,12.56) v2(74.3,46.34) v2(74.3,45.2) v2(74.36,56.05) v2(74.36,54.53) v2(74.36,53.01) v2(74.42,38.72) v2(74.43,37.58) v2(74.67,13.7) v2(74.67,12.56) v2(75.5,56.06) v2(75.5,54.54) v2(75.5,53.01) v2(75.82,46.34) v2(75.82,45.2) v2(75.94,38.72) v2(75.95,37.58) v2(76.84,23.99) v2(76.84,22.85) v2(77.34,46.34) v2(77.34,45.2) v2(77.47,38.72) v2(77.47,37.58) v2(78.11,97.02) v2(78.11,95.87) v2(78.36,23.99) v2(78.36,22.85) v2(79.63,97.02) v2(79.63,95.87) v2(79.88,23.99) v2(79.88,22.85) v2(81.15,97.02) v2(81.15,95.87) v2(83.44,15.1) v2(83.44,13.96) v2(84.96,15.1) v2(84.96,13.96) v2(86.36,4.18) v2(86.36,3.04) v2(86.48,15.1) v2(86.49,13.96) v2(87.88,4.18) v2(87.89,3.04) v2(89.41,97.14) v2(89.41,96) v2(89.4,4.18) v2(89.41,3.04) v2(90.93,97.14) v2(90.93,96) v2(91.5,60.88) v2(91.5,59.36) v2(91.5,57.84) v2(92.45,97.14) v2(92.45,96) v2(92.65,60.88) v2(92.65,59.36) v2(92.65,57.84) v2(96.08,12.49) v2(96.08,10.97) v2(96.08,9.45) v2(96.2,93.27) v2(96.2,91.74) v2(96.2,90.22) v2(96.2,86.92) v2(96.2,85.39) v2(96.2,83.87) v2(96.2,74.6) v2(96.2,73.07) v2(96.2,71.55) v2(96.2,60.88) v2(96.2,59.36) v2(96.2,57.84) v2(96.2,36.11) v2(96.2,34.59) v2(96.2,33.07) v2(97.22,12.5) v2(97.22,10.97) v2(97.22,9.45) v2(97.35,93.27) v2(97.35,91.75) v2(97.35,90.22) v2(97.35,86.92) v2(97.35,85.4) v2(97.35,83.88) v2(97.35,74.6) v2(97.35,73.08) v2(97.35,71.56) v2(97.35,60.88) v2(97.35,59.36) v2(97.35,57.84) v2(97.35,36.12) v2(97.35,34.6) v2(97.35,33.08)
(no net):
  vias: v1(3.4,96.6) v1(3.4,3.4) v1(96.6,96.6) v1(96.6,3.4)
PA0: length 47.9
  Top Layer w0.406: 56.73,30.86 H2.16 ; v3(83.19,49.45) 81.29,49.45
  Bottom Layer w0.406: H2.16 83,30.86 84.46,32.31 84.46,48.18 v3(83.19,49.45)
PA1: length 12.4
  Top Layer w0.406: 56.73,33.4 H2.15
PA2: length 30.2
  Top Layer w0.406: v3(81.15,39.17) 81.21,39.23 81.21,42.36 ; 56.73,35.94 H2.14
  Bottom Layer w0.406: H2.14 80.08,35.94 81.15,37.01 v3(81.15,39.17)
PA3: length 12.4
  Top Layer w0.406: 56.73,38.48 H2.13
PA4: length 29.1
  Top Layer w0.406: 56.73,41.02 H2.12 71.68,41.02 72.64,40.06 72.64,36.25 73.64,35.25 81.21,35.25
PA5: length 113
  Top Layer w0.406: 56.73,43.56 H2.11 ; Water_Place.1 8.25,46.66 22.73,46.66 24.77,48.69 24.77,70.54 27.18,72.95 41.91,72.95 43.81,71.04 v3(43.81,43.61)
  Bottom Layer w0.406: v3(43.81,43.61) 43.94,43.48 STM32F103C8T6.30
PA6: length 100.1
  Top Layer w0.406: 56.73,46.1 H2.10 ; 18.29,50.72 18.29,55.3 20.45,57.45 20.45,72.69 22.61,74.85 43.69,74.85 45.72,72.82 v3(45.72,46.03)
  Bottom Layer w0.406: v3(45.72,46.03) STM32F103C8T6.31
PA7: length 115.8
  Top Layer w0.406: 56.73,48.64 H2.9 ; v3(60.45,12.27) 60.45,18.97 v3(60.32,19.1)
  Bottom Layer w0.406: LED_YELLOW.1 18.16,34.59 23.24,29.51 23.24,14.28 25.24,12.27 v3(60.45,12.27) ; STM32F103C8T6.32 56.9,48.69 58.55,48.69 60.32,46.91 v3(60.32,19.1)
PA8: length 76.3
  Top Layer w0.406: 41.49,58.8 H1.5
  Bottom Layer w0.406: 5.72,17.96 5.72,21.9 3.05,24.56 3.05,51.87 6.22,55.04 15.88,55.04 19.56,58.72 29.04,58.72 H1.5
PA9: length 12.4
  Top Layer w0.406: 41.49,56.26 H1.6
PA10: length 12.4
  Top Layer w0.406: 41.49,53.72 H1.7
PA11: length 12.4
  Top Layer w0.406: 41.49,51.18 H1.8
PA12: length 12.4
  Top Layer w0.406: 41.49,48.64 H1.9
PA15: length 12.4
  Top Layer w0.406: 41.49,46.1 H1.10
PB0: length 114.4
  Top Layer w0.406: v3(62.61,10.59) v3(62.61,19.23) ; 56.73,51.18 H2.8
  Bottom Layer w0.406: STM32F103C8T6.33 56.9,51.23 61.09,51.23 62.61,49.71 v3(62.61,19.23) ; v3(62.61,10.59) 23.88,10.59 20.95,13.51 20.95,18.09 18.16,20.88 18.16,25.83
PB1: length 139
  Top Layer w0.406: v3(64.9,8.81) v3(64.9,19.23) ; 56.73,53.72 H2.7
  Bottom Layer w0.406: v3(64.9,8.81) 22.73,8.81 18.99,12.56 18.99,17.26 15.37,20.88 10.03,20.88 6.86,24.05 6.86,31.42 6.98,31.42 ; STM32F103C8T6.34 56.9,53.77 62.99,53.77 64.9,51.87 v3(64.9,19.23)
PB3: length 12.4
  Top Layer w0.406: 41.49,43.56 H1.11
PB4: length 12.4
  Top Layer w0.406: 41.49,41.02 H1.12
PB5: length 12.4
  Top Layer w0.406: 41.49,38.48 H1.13
PB6: length 100.1
  Top Layer w0.406: v3(50.55,35.86) 50.55,62.79 51.82,64.06 v3(51.82,66.09) ; 41.49,35.94 H1.14
  Bottom Layer w0.406: v3(51.82,66.09) 51.82,70.03 55.25,73.46 72.39,73.46 75.18,70.66 75.18,62.66 78.36,59.49 LED_Fill_Light.1 ; STM32F103C8T6.14 v3(50.55,35.86)
PB7: length 12.4
  Top Layer w0.406: 41.49,33.4 H1.15
PB8: length 74.9
  Top Layer w0.406: 41.49,30.86 H1.16
  Bottom Layer w0.406: 41.49,30.86 39.19,30.86 37.59,29.26 37.59,17.58 40.13,15.04 76.71,15.04 78.49,13.26 OLED.3
PB9: length 66
  Top Layer w0.406: 41.49,28.32 H1.17
  Bottom Layer w0.406: OLED.4 81.03,14.78 78.87,16.94 53.85,16.94 50.16,20.62 50.16,26.47 48.32,28.32 41.49,28.32
PB10: length 12.4
  Top Layer w0.406: 56.73,56.26 H2.6
PB11: length 81.9
  Top Layer w0.406: STM32F103C8T6.36 56.84,58.8 H2.5 69.17,58.85 77.34,58.85 78.87,57.33 78.87,54.53 80.52,52.88 90.42,52.88 92.17,51.14 92.17,24.47 90.68,22.97 82.74,22.97 81.21,24.5 KEY3.1
PB12: length 63.8
  Top Layer w0.406: 41.49,68.96 H1.1
  Bottom Layer w0.406: DS1302.5 74.17,78.28 72.26,76.38 43.05,76.38 41.53,74.85 STM32F103C8T6.1
PB13: length 64
  Top Layer w0.406: 41.49,66.42 H1.2
  Bottom Layer w0.406: DS1302.3 75.06,73.2 73.53,74.73 45.97,74.73 44.83,73.58 44.83,67.61 43.56,66.34 STM32F103C8T6.2
PB14: length 65.3
  Top Layer w0.406: DS1302.4 85.47,75.62 76.33,75.62 73.91,73.2 v3(50.93,73.2) ; 41.49,63.88 H1.3
  Bottom Layer w0.406: v3(50.93,73.2) 49.91,72.19 49.91,65.46 48.26,63.81 STM32F103C8T6.3
PB15: length 12.4
  Top Layer w0.406: 41.49,61.34 H1.4
PC13: length 12.4
  Top Layer w0.406: 56.73,23.24 H2.19
PC14: length 28.6
  Top Layer w0.406: STM32F103C8T6.23 67.73,25.71 67.8,25.78 H2.18 69.18,25.71 73.66,25.71 75.18,24.18 75.18,21.39 76.76,19.82 KEY4.1
PC15: length 12.4
  Top Layer w0.406: 56.73,28.32 H2.17
R: length 12.4
  Top Layer w0.406: 56.73,61.34 H2.4
VB: length 12.4
  Top Layer w0.406: 56.73,20.7 H2.20
$3N3363: length 105.3
  Top Layer w1.016: POWER.2 15.88,64.57 17.53,66.22 17.53,81.46 16.32,82.67 DC 12V.1 14.18,93.22 17.53,96.57 67.56,96.57 69.22,94.92 69.22,92.13 69.34,92 ; 76.96,92 +12V.3 71.88,92 ; 69.34,92.03 71.75,92.03

## Copper pours and planes (outline as drawn; the poured copper is in the pictures)
GND on Top Layer: -7.37,104.06 108.2,104.06 108.2,-3.12 -7.37,-3.12
GND on Bottom Layer: -10.92,106.48 112.01,106.48 112.01,-4.65 -10.92,-4.65

Small or netless copper shapes (teardrops, artwork), in the pictures only: 156 on Top Layer, 39 on Bottom Layer

## Text on the board
Bottom Silkscreen Layer: 何晓燊 202334510106 / 朱煜晨 202334510131 / 黄越青 202334510211 / 王湘权 202334510122
Top Silkscreen Layer: PB12 | PB13 | PB14 | PB15 | PA8 | PA9 | PA10 | PA11 | PA12 | PA15 | PB3 | PB4 | PB5 | PB6 | PB7 | P8 | PB9 | +5V | GND | +3.3V | PC14 | PC15 | PC13 | PB10 | PB11 | PA4 | PA7 | PA5 | PA3 | PA2 | PA0 | PA6 | PB0 | PA1 | PB1 | VB | R | VCC | SCL | SDA | S | + | - | RST | DAT | CLK | OFF | ON | 水位 / 过高 / 干旱 | 水位 / 正常 | 水位 / 很高 | 鱼缸灯 | 植物补光灯 | 下一项 | 上一项 | 菜单/确认 | 加1/手动喂食 | 减1 | 鱼缸喂食控制系统
